# EAGLE design Gauge DAC v2 (EAGLE 9.1.0)
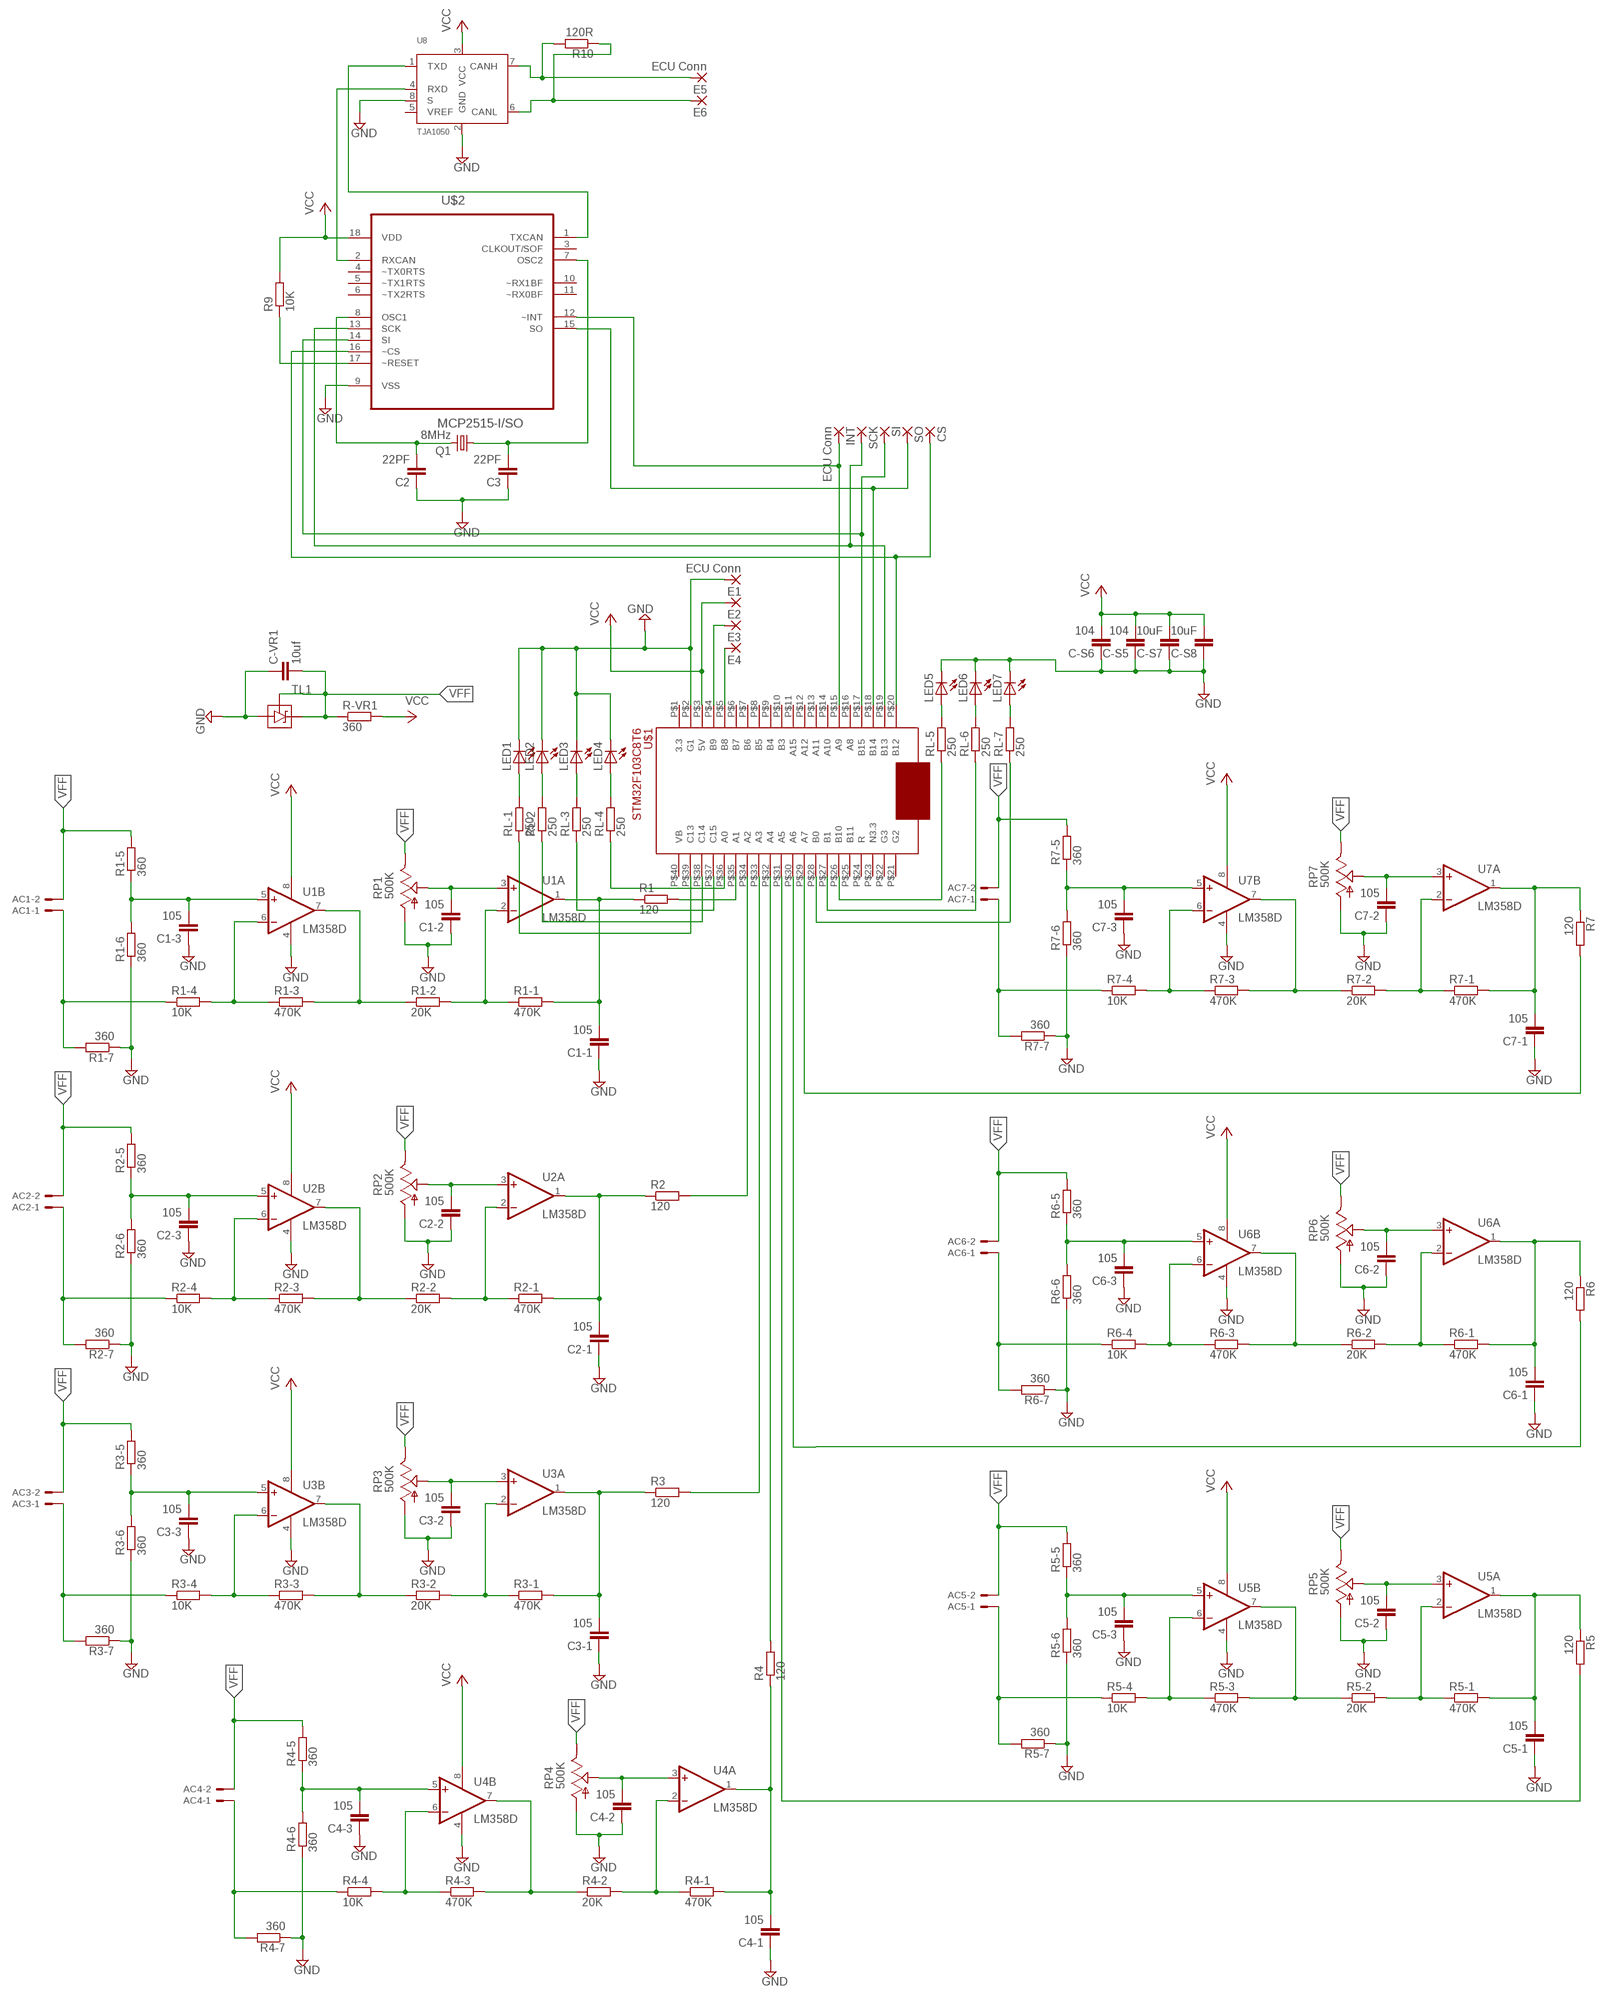
[diagram p0: schematic, sheet 1]

## Parts
AC1  JST-XH-02-PIN-ROUND-PAD  [JST-XH-02-PACKAGE-ROUND-PAD]
AC2  JST-XH-02-PIN-ROUND-PAD  [JST-XH-02-PACKAGE-ROUND-PAD]
AC3  JST-XH-02-PIN-ROUND-PAD  [JST-XH-02-PACKAGE-ROUND-PAD]
AC4  JST-XH-02-PIN-ROUND-PAD  [JST-XH-02-PACKAGE-ROUND-PAD]
AC5  JST-XH-02-PIN-ROUND-PAD  [JST-XH-02-PACKAGE-ROUND-PAD]
AC6  JST-XH-02-PIN-ROUND-PAD  [JST-XH-02-PACKAGE-ROUND-PAD]
AC7  JST-XH-02-PIN-ROUND-PAD  [JST-XH-02-PACKAGE-ROUND-PAD]
C1-1  105  C-EUC0805  [C0805]
C1-2  105  C-EUC0805  [C0805]
C1-3  105  C-EUC0805  [C0805]
C2  22PF  C-EUC0805  [C0805]
C2-1  105  C-EUC0805  [C0805]
C2-2  105  C-EUC0805  [C0805]
C2-3  105  C-EUC0805  [C0805]
C3  22PF  C-EUC0805  [C0805]
C3-1  105  C-EUC0805  [C0805]
C3-2  105  C-EUC0805  [C0805]
C3-3  105  C-EUC0805  [C0805]
C4-1  105  C-EUC0805  [C0805]
C4-2  105  C-EUC0805  [C0805]
C4-3  105  C-EUC0805  [C0805]
C5-1  105  C-EUC0805  [C0805]
C5-2  105  C-EUC0805  [C0805]
C5-3  105  C-EUC0805  [C0805]
C6-1  105  C-EUC0805  [C0805]
C6-2  105  C-EUC0805  [C0805]
C6-3  105  C-EUC0805  [C0805]
C7-1  105  C-EUC0805  [C0805]
C7-2  105  C-EUC0805  [C0805]
C7-3  105  C-EUC0805  [C0805]
C-S5  104  C-EUC0805  [C0805]
C-S6  104  C-EUC0805  [C0805]
C-S7  10uF  C-EUC0805  [C0805]
C-S8  10uF  C-EUC0805  [C0805]
C-VR1  10uf  C-EUC0805  [C0805]
CS  WIREPADSMD1,27-254  [SMD1,27-2,54]
E1  ECU Conn  WIREPADSMD1,27-254  [SMD1,27-2,54]
E2  WIREPADSMD1,27-254  [SMD1,27-2,54]
E3  WIREPADSMD1,27-254  [SMD1,27-2,54]
E4  WIREPADSMD1,27-254  [SMD1,27-2,54]
E5  ECU Conn  WIREPADSMD1,27-254  [SMD1,27-2,54]
E6  WIREPADSMD1,27-254  [SMD1,27-2,54]
INT  ECU Conn  WIREPADSMD1,27-254  [SMD1,27-2,54]
LED1  LEDCHIP-LED0805  [CHIP-LED0805]
LED2  LEDCHIP-LED0805  [CHIP-LED0805]
LED3  LEDCHIP-LED0805  [CHIP-LED0805]
LED4  LEDCHIP-LED0805  [CHIP-LED0805]
LED5  LEDCHIP-LED0805  [CHIP-LED0805]
LED6  LEDCHIP-LED0805  [CHIP-LED0805]
LED7  LEDCHIP-LED0805  [CHIP-LED0805]
Q1  8MHz  CRYSTALHC49S  [HC49/S]
R1  120  R-EU_M0805  [M0805]
R1-1  470K  R-EU_M0805  [M0805]
R1-2  20K  R-EU_M0805  [M0805]
R1-3  470K  R-EU_M0805  [M0805]
R1-4  10K  R-EU_M0805  [M0805]
R1-5  360  R-EU_M0805  [M0805]
R1-6  360  R-EU_M0805  [M0805]
R1-7  360  R-EU_M0805  [M0805]
R2  120  R-EU_M0805  [M0805]
R2-1  470K  R-EU_M0805  [M0805]
R2-2  20K  R-EU_M0805  [M0805]
R2-3  470K  R-EU_M0805  [M0805]
R2-4  10K  R-EU_M0805  [M0805]
R2-5  360  R-EU_M0805  [M0805]
R2-6  360  R-EU_M0805  [M0805]
R2-7  360  R-EU_M0805  [M0805]
R3  120  R-EU_M0805  [M0805]
R3-1  470K  R-EU_M0805  [M0805]
R3-2  20K  R-EU_M0805  [M0805]
R3-3  470K  R-EU_M0805  [M0805]
R3-4  10K  R-EU_M0805  [M0805]
R3-5  360  R-EU_M0805  [M0805]
R3-6  360  R-EU_M0805  [M0805]
R3-7  360  R-EU_M0805  [M0805]
R4  120  R-EU_M0805  [M0805]
R4-1  470K  R-EU_M0805  [M0805]
R4-2  20K  R-EU_M0805  [M0805]
R4-3  470K  R-EU_M0805  [M0805]
R4-4  10K  R-EU_M0805  [M0805]
R4-5  360  R-EU_M0805  [M0805]
R4-6  360  R-EU_M0805  [M0805]
R4-7  360  R-EU_M0805  [M0805]
R5  120  R-EU_M0805  [M0805]
R5-1  470K  R-EU_M0805  [M0805]
R5-2  20K  R-EU_M0805  [M0805]
R5-3  470K  R-EU_M0805  [M0805]
R5-4  10K  R-EU_M0805  [M0805]
R5-5  360  R-EU_M0805  [M0805]
R5-6  360  R-EU_M0805  [M0805]
R5-7  360  R-EU_M0805  [M0805]
R6  120  R-EU_M0805  [M0805]
R6-1  470K  R-EU_M0805  [M0805]
R6-2  20K  R-EU_M0805  [M0805]
R6-3  470K  R-EU_M0805  [M0805]
R6-4  10K  R-EU_M0805  [M0805]
R6-5  360  R-EU_M0805  [M0805]
R6-6  360  R-EU_M0805  [M0805]
R6-7  360  R-EU_M0805  [M0805]
R7  120  R-EU_M0805  [M0805]
R7-1  470K  R-EU_M0805  [M0805]
R7-2  20K  R-EU_M0805  [M0805]
R7-3  470K  R-EU_M0805  [M0805]
R7-4  10K  R-EU_M0805  [M0805]
R7-5  360  R-EU_M0805  [M0805]
R7-6  360  R-EU_M0805  [M0805]
R7-7  360  R-EU_M0805  [M0805]
R9  10K  R-EU_M0805  [M0805]
R10  120R  R-EU_M0805  [M0805]
R-VR1  360  R-EU_M0805  [M0805]
RL-1  250  R-EU_M0805  [M0805]
RL-2  250  R-EU_M0805  [M0805]
RL-3  250  R-EU_M0805  [M0805]
RL-4  250  R-EU_M0805  [M0805]
RL-5  250  R-EU_M0805  [M0805]
RL-6  250  R-EU_M0805  [M0805]
RL-7  250  R-EU_M0805  [M0805]
RP1  500K  TRIM_US-B64Y  [B64Y]
RP2  500K  TRIM_US-B64Y  [B64Y]
RP3  500K  TRIM_US-B64Y  [B64Y]
RP4  500K  TRIM_US-B64Y  [B64Y]
RP5  500K  TRIM_US-B64Y  [B64Y]
RP6  500K  TRIM_US-B64Y  [B64Y]
RP7  500K  TRIM_US-B64Y  [B64Y]
SCK  WIREPADSMD1,27-254  [SMD1,27-2,54]
SI  WIREPADSMD1,27-254  [SMD1,27-2,54]
SO  WIREPADSMD1,27-254  [SMD1,27-2,54]
TL1  TL431SOT23  [SOT23]
U1  LM358D  [SO08]
U2  LM358D  [SO08]
U3  LM358D  [SO08]
U4  LM358D  [SO08]
U5  LM358D  [SO08]
U6  LM358D  [SO08]
U7  LM358D  [SO08]
U8  TJA1050  [SOT96-1]
U$1  STM32F103C8T6DIP40  [STM32]
U$2  MCP2515-I/SO  [SOIC127P1034X264-18N]

## Nets
GND: C1-1.1 C1-2.1 C1-3.1 C2-1.1 C2-2.1 C2-3.1 C2.1 C3-1.1 C3-2.1 C3-3.1 C3.1 C4-1.1 C4-2.1 C4-3.1 C5-1.1 C5-2.1 C5-3.1 C6-1.1 C6-2.1 C6-3.1 C7-1.1 C7-2.1 C7-3.1 C-S5.1 C-S6.1 C-S7.1 C-S8.1 C-VR1.1 E1.1(P) LED1.C LED2.C LED3.C LED4.C LED5.C LED6.C LED7.C R1-6.1 R1-7.1 R2-6.1 R2-7.1 R3-6.1 R3-7.1 R4-6.1 R4-7.1 R5-6.1 R5-7.1 R6-6.1 R6-7.1 R7-6.1 R7-7.1 RP1.A RP2.A RP3.A RP4.A RP5.A RP6.A RP7.A TL1.3(ANODE) U1.4(P:V-) U2.4(P:V-) U3.4(P:V-) U4.4(P:V-) U5.4(P:V-) U6.4(P:V-) U7.4(P:V-) U8.2(GND) U8.8(S) U$1.P$2(G1) U$2.9(VSS)
N$1: SCK.1(P) U$1.P$19(B13) U$2.13(SCK)
N$2: CS.1(P) U$1.P$20(B12) U$2.16(~CS)
N$3: E3.1(P) U$1.P$4(B9)
N$4: E4.1(P) U$1.P$5(B8)
N$5: U8.1(TXD) U$2.1(TXCAN)
N$6: SO.1(P) U$1.P$18(B14) U$2.15(SO)
N$7: SI.1(P) U$1.P$17(B15) U$2.14(SI)
N$8: RL-4.1 U$1.P$36(A0)
N$9: RL-3.1 U$1.P$37(C15)
N$10: C7-1.2 R7-1.2 R7.1 U7.1(A:OUT)
N$11: C1-2.2 RP1.S U1.3(A:+IN)
N$12: R1-2.1 R1-3.2 U1.7(B:OUT)
N$13: R1-1.1 R1-2.2 U1.2(A:-IN)
N$14: RL-2.1 U$1.P$38(C14)
N$15: C1-3.2 R1-5.1 R1-6.2 U1.5(B:+IN)
N$16: R1-3.1 R1-4.2 U1.6(B:-IN)
N$17: AC1.1 R1-4.1 R1-7.2
N$18: C2-2.2 RP2.S U2.3(A:+IN)
N$19: R2-2.1 R2-3.2 U2.7(B:OUT)
N$20: R2-1.1 R2-2.2 U2.2(A:-IN)
N$21: C2-1.2 R2-1.2 R2.1 U2.1(A:OUT)
N$22: C2-3.2 R2-5.1 R2-6.2 U2.5(B:+IN)
N$23: R2-3.1 R2-4.2 U2.6(B:-IN)
N$24: AC2.1 R2-4.1 R2-7.2
N$25: RL-1.1 U$1.P$39(C13)
N$26: LED1.A RL-1.2
N$27: RL-7.1 U$1.P$28(B0)
N$28: RL-6.1 U$1.P$27(B1)
N$29: RL-5.1 U$1.P$26(B10)
N$30: LED2.A RL-2.2
N$31: LED3.A RL-3.2
N$32: C3-2.2 RP3.S U3.3(A:+IN)
N$33: R3-2.1 R3-3.2 U3.7(B:OUT)
N$34: R3-1.1 R3-2.2 U3.2(A:-IN)
N$35: C3-1.2 R3-1.2 R3.1 U3.1(A:OUT)
N$36: C3-3.2 R3-5.1 R3-6.2 U3.5(B:+IN)
N$37: R3-3.1 R3-4.2 U3.6(B:-IN)
N$38: AC3.1 R3-4.1 R3-7.2
N$39: LED4.A RL-4.2
N$40: LED5.A RL-5.2
N$41: LED6.A RL-6.2
N$42: LED7.A RL-7.2
N$44: R9.1 U$2.17(~RESET)
N$46: C4-2.2 RP4.S U4.3(A:+IN)
N$47: R4-2.1 R4-3.2 U4.7(B:OUT)
N$48: R4-1.1 R4-2.2 U4.2(A:-IN)
N$49: C4-1.2 R4-1.2 R4.1 U4.1(A:OUT)
N$50: C4-3.2 R4-5.1 R4-6.2 U4.5(B:+IN)
N$51: R4-3.1 R4-4.2 U4.6(B:-IN)
N$52: AC4.1 R4-4.1 R4-7.2
N$53: E6.1(P) R10.1 U8.6(CANL)
N$54: U8.4(RXD) U$2.2(RXCAN)
N$55: INT.1(P) U$1.P$15(A9) U$2.12(~INT)
N$60: C5-2.2 RP5.S U5.3(A:+IN)
N$61: R5-2.1 R5-3.2 U5.7(B:OUT)
N$62: R5-1.1 R5-2.2 U5.2(A:-IN)
N$63: C2.2 Q1.2 U$2.8(OSC1)
N$64: C5-3.2 R5-5.1 R5-6.2 U5.5(B:+IN)
N$65: R5-3.1 R5-4.2 U5.6(B:-IN)
N$66: AC5.1 R5-4.1 R5-7.2
N$67: C3.2 Q1.1 U$2.7(OSC2)
N$70: E5.1(P) R10.2 U8.7(CANH)
N$74: C6-2.2 RP6.S U6.3(A:+IN)
N$75: R6-2.1 R6-3.2 U6.7(B:OUT)
N$76: R6-1.1 R6-2.2 U6.2(A:-IN)
N$78: C6-3.2 R6-5.1 R6-6.2 U6.5(B:+IN)
N$79: R6-3.1 R6-4.2 U6.6(B:-IN)
N$80: AC6.1 R6-4.1 R6-7.2
N$88: C7-2.2 RP7.S U7.3(A:+IN)
N$89: R7-2.1 R7-3.2 U7.7(B:OUT)
N$90: R7-1.1 R7-2.2 U7.2(A:-IN)
N$92: C7-3.2 R7-5.1 R7-6.2 U7.5(B:+IN)
N$93: R7-3.1 R7-4.2 U7.6(B:-IN)
N$94: AC7.1 R7-4.1 R7-7.2
R1: R1.2 U$1.P$35(A1)
R2: R2.2 U$1.P$34(A2)
R3: R3.2 U$1.P$33(A3)
R4: R4.2 U$1.P$32(A4)
R5: R5.2 U$1.P$31(A5)
R6: R6.2 U$1.P$30(A6)
R7: R7.2 U$1.P$29(A7)
U1-1: C1-1.2 R1-1.2 R1.1 U1.1(A:OUT)
U5-1: C5-1.2 R5-1.2 R5.1 U5.1(A:OUT)
U6-1: C6-1.2 R6-1.2 R6.1 U6.1(A:OUT)
VCC: C-S5.2 C-S6.2 C-S7.2 C-S8.2 E2.1(P) R9.2 R-VR1.2 U1.8(P:V+) U2.8(P:V+) U3.8(P:V+) U4.8(P:V+) U5.8(P:V+) U6.8(P:V+) U7.8(P:V+) U8.3(VCC) U$1.P$3(5V) U$2.18(VDD)
VFF: AC1.2 AC2.2 AC3.2 AC4.2 AC5.2 AC6.2 AC7.2 C-VR1.2 R1-5.2 R2-5.2 R3-5.2 R4-5.2 R5-5.2 R6-5.2 R7-5.2 R-VR1.1 RP1.E RP2.E RP3.E RP4.E RP5.E RP6.E RP7.E TL1.1(CATHODE) TL1.2(REF)
Unconnected: U8.5(VREF) U$1.P$1(3.3) U$1.P$6(B7) U$1.P$7(B6) U$1.P$8(B5) U$1.P$9(B4) U$1.P$10(B3) U$1.P$11(A15) U$1.P$12(A12) U$1.P$13(A11) U$1.P$14(A10) U$1.P$16(A8) U$1.P$21(G2) U$1.P$22(G3) U$1.P$23(N3.3) U$1.P$24(R) U$1.P$25(B11) U$1.P$40(VB) U$2.3(CLKOUT/SOF) U$2.4(~TX0RTS) U$2.5(~TX1RTS) U$2.6(~TX2RTS) U$2.10(~RX1BF) U$2.11(~RX0BF)

## Library data of the parts
AC1-AC7 = Rembrandt Electronics - JST XH Connectors v1-0:JST-XH-02-PIN: JST XH Connector 2 Pin Wire to board connector. Pitch: 2,54 mm, (0.100") Number of pins: 2 Created by Rembrandt Electronics www.rembrandtelectronics.com
C1-1-C1-3 C2 C2-1-C2-3 C3 C3-1-C3-3 C4-1-C4-3 C5-1-C5-3 C6-1-C6-3 C7-1-C7-3 C-S5-C-S8 C-VR1 = rcl:C-EU: CAPACITOR, European symbol; SPICEPREFIX: C
CS E1-E6 INT SCK SI SO = wirepad:WIREPAD: Wire PAD connect wire on PCB
LED1-LED7 = led:LED: LED OSRAM: - CHIPLED LG R971, LG N971, LY N971, LG Q971, LY Q971, LO R971, LY R971 LH N974, LH R974 LS Q976, LO Q976, LY Q976 LO Q996 - Hyper CHIPLED LW Q18S LB Q993, LB Q99A, LB R99A - SideLED LS A670, LO A670, LY A670, LG A670, LP A670 LB A673, LV A673, LT A673, LW A673 LH A674 LY A675 LS A676, LA A676, LO A676, LY A676, LW A676 LS A679, LY A679, LG A679 - Hyper Micro SIDELED® LS Y876, LA Y876, LO Y876, LY Y876 LT Y87S - SmartLED LW L88C, LW L88S LB L89C, LB L89S, LG L890 LS L89K, LO L89K, LY L89K LS L896, LA L896, LO L896, LY L896 - TOPLED LS T670, LO T670, LY T670, LG T670, LP T670 LSG T670, LSP T670, LSY T670, LOP T670, LYG T670 LG T671, LOG T671, LSG T671 LB T673, LV T673, LT T673, LW T673 LH T674 LS T676, LA T676, LO T676, LY T676, LB T676, LH T676, LSB T676, LW T676 LB T67C, LV T67C, LT T67C, LS T67K, LO T67K, LY T67K, LW E67C LS E67B, LA E67B, LO E67B, LY E67B, LB E67C, LV E67C, LT E67C LW T67C LS T679, LY T679, LG T679 LS T770, LO T770, LY T770, LG T770, LP T770 LB T773, LV T773, LT T773, LW T773 LH T774 LS E675, LA E675, LY E675, LS T675 LS T776, LA T776, LO T776, LY T776, LB T776 LHGB T686 LT T68C, LB T68C - Hyper Mini TOPLED® LB M676 - Mini TOPLED Santana® LG M470 LS M47K, LO M47K, LY M47K Source: http://www.osram.convergy.de LUXEON: - LUMILED® LXK2-PW12-R00, LXK2-PW12-S00, LXK2-PW14-U00, LXK2-PW14-V00 LXK2-PM12-R00, LXK2-PM12-S00, LXK2-PM14-U00 LXK2-PE12-Q00, LXK2-PE12-R00, LXK2-PE12-S00, LXK2-PE14-T00, LXK2-PE14-U00 LXK2-PB12-K00, LXK2-PB12-L00, LXK2-PB12-M00, LXK2-PB14-N00, LXK2-PB14-P00, LXK2-PB14-Q00 LXK2-PR12-L00, LXK2-PR12-M00, LXK2-PR14-Q00, LXK2-PR14-R00 LXK2-PD12-Q00, LXK2-PD12-R00, LXK2-PD12-S00 LXK2-PH12-R00, LXK2-PH12-S00 LXK2-PL12-P00, LXK2-PL12-Q00, LXK2-PL12-R00 Source: www.luxeon.com KINGBRIGHT: KA-3528ASYC Source: www.kingbright.com
Q1 = crystal:CRYSTAL: CRYSTAL; OC_FARNELL: 1667008; OC_NEWARK: unknown
R1 R1-1-R1-7 R2 R2-1-R2-7 R3 R3-1-R3-7 R4 R4-1-R4-7 R5 R5-1-R5-7 R6 R6-1-R6-7 R7 R7-1-R7-7 R9 R10 R-VR1 RL-1-RL-7 = rcl:R-EU_: RESISTOR, European symbol; SPICEPREFIX: R
RP1-RP7 = pot:TRIM_US-: POTENTIOMETER; SPICEPREFIX: J
TL1 = Components:TL431: TL431 Adjustable Voltage Regular SOT-23-3
U1-U7 = linear:LM358: OP AMP also LM158; LM258; LM2904 Source: http://cache.national.com/ds/LM/LM158.pdf; SPICEPREFIX: J
U8 = TJA1050:TJA1050: High speed CAN transceiver The TJA1050 is the interface between the Controller Area Network (CAN) protocol controller and the physical bus. The device provides differential transmit capability to the bus and differential receive capability to the CAN controller. The TJA1050 is the third Philips high-speed CAN transceiver after the PCA82C250 and the PCA82C251. The most important differences are: Much lower electromagnetic emission due to optimal matching of the output signals CANH and CANL Improved behaviour in case of an unpowered node No standby mode. This makes the TJA1050 eminently suitable for use in nodes that are in a power-down situation in partially powered networks. AAL Eindhoven MK; AVAILABILITY: Unavailable; MF: NXP Semiconductors; MP: TJA1050; PACKAGE: None; PRICE: None
U$1 = Components:STM32F103C8T6
U$2 = MCP2515-I_SO:MCP2515-I/SO: CAN Controller; AVAILABILITY: Unavailable; DESCRIPTION: MCP2515 Series 5.5 V 1 Mb/s Stand Alone SPI Interface CAN Controller- SOIC-18; MF: Microchip; MP: MCP2515-I/SO; PACKAGE: SOIC-18 Microchip; PRICE: None

## Board
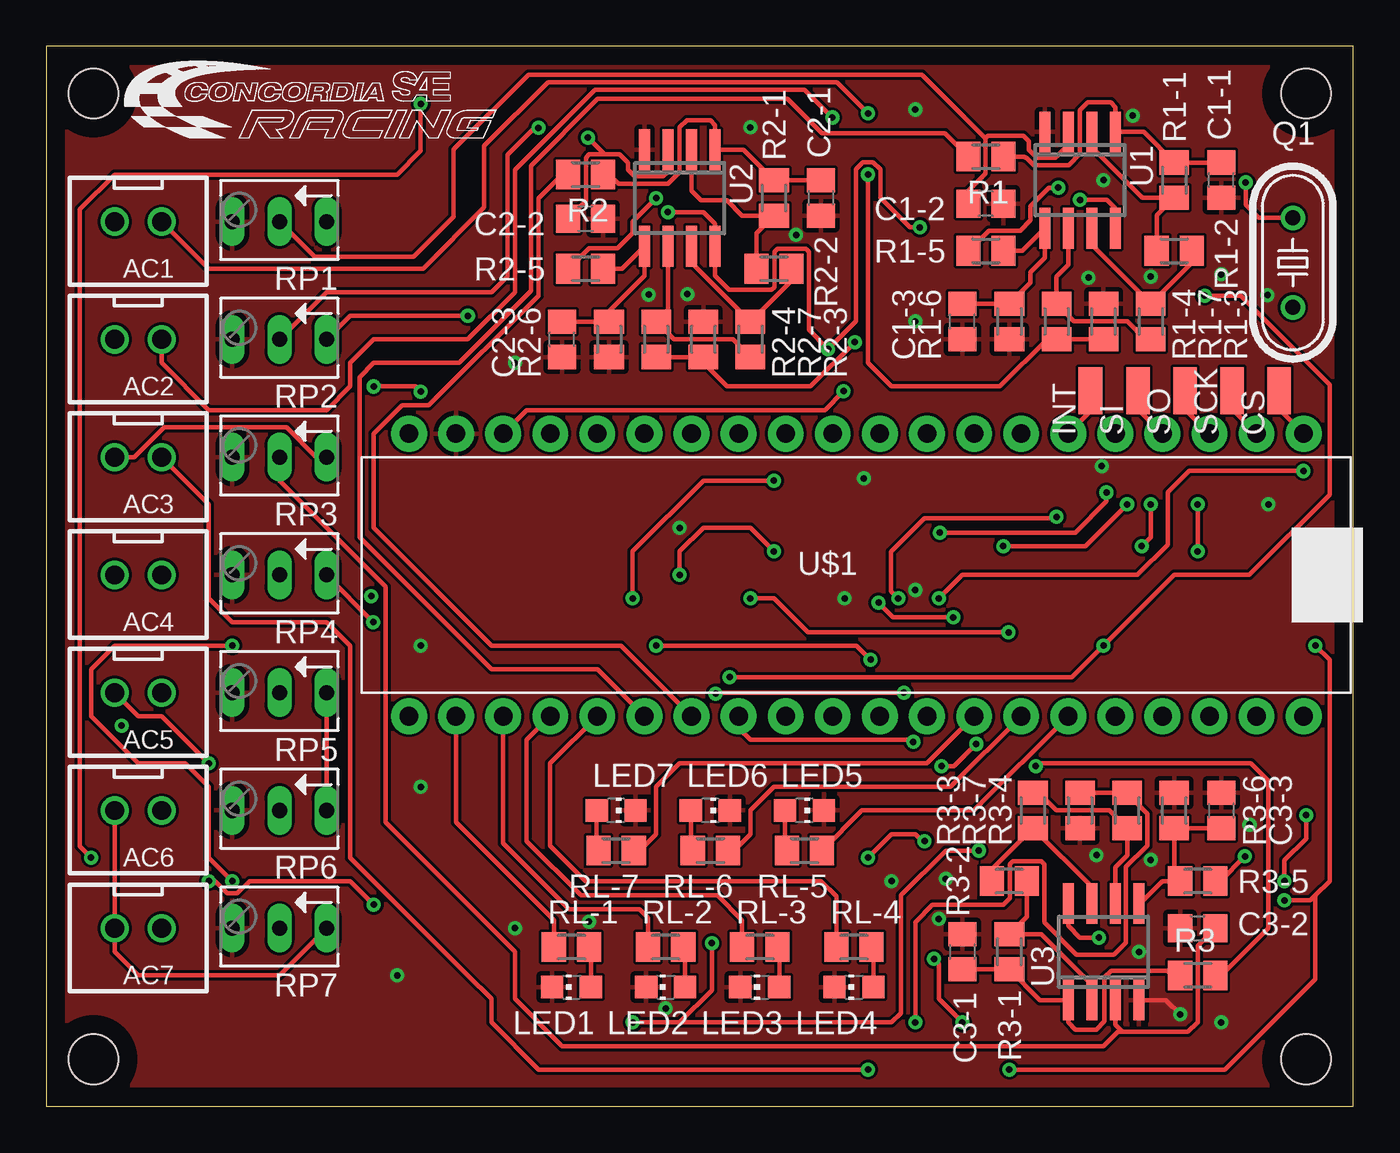
[diagram p1: board, top side]
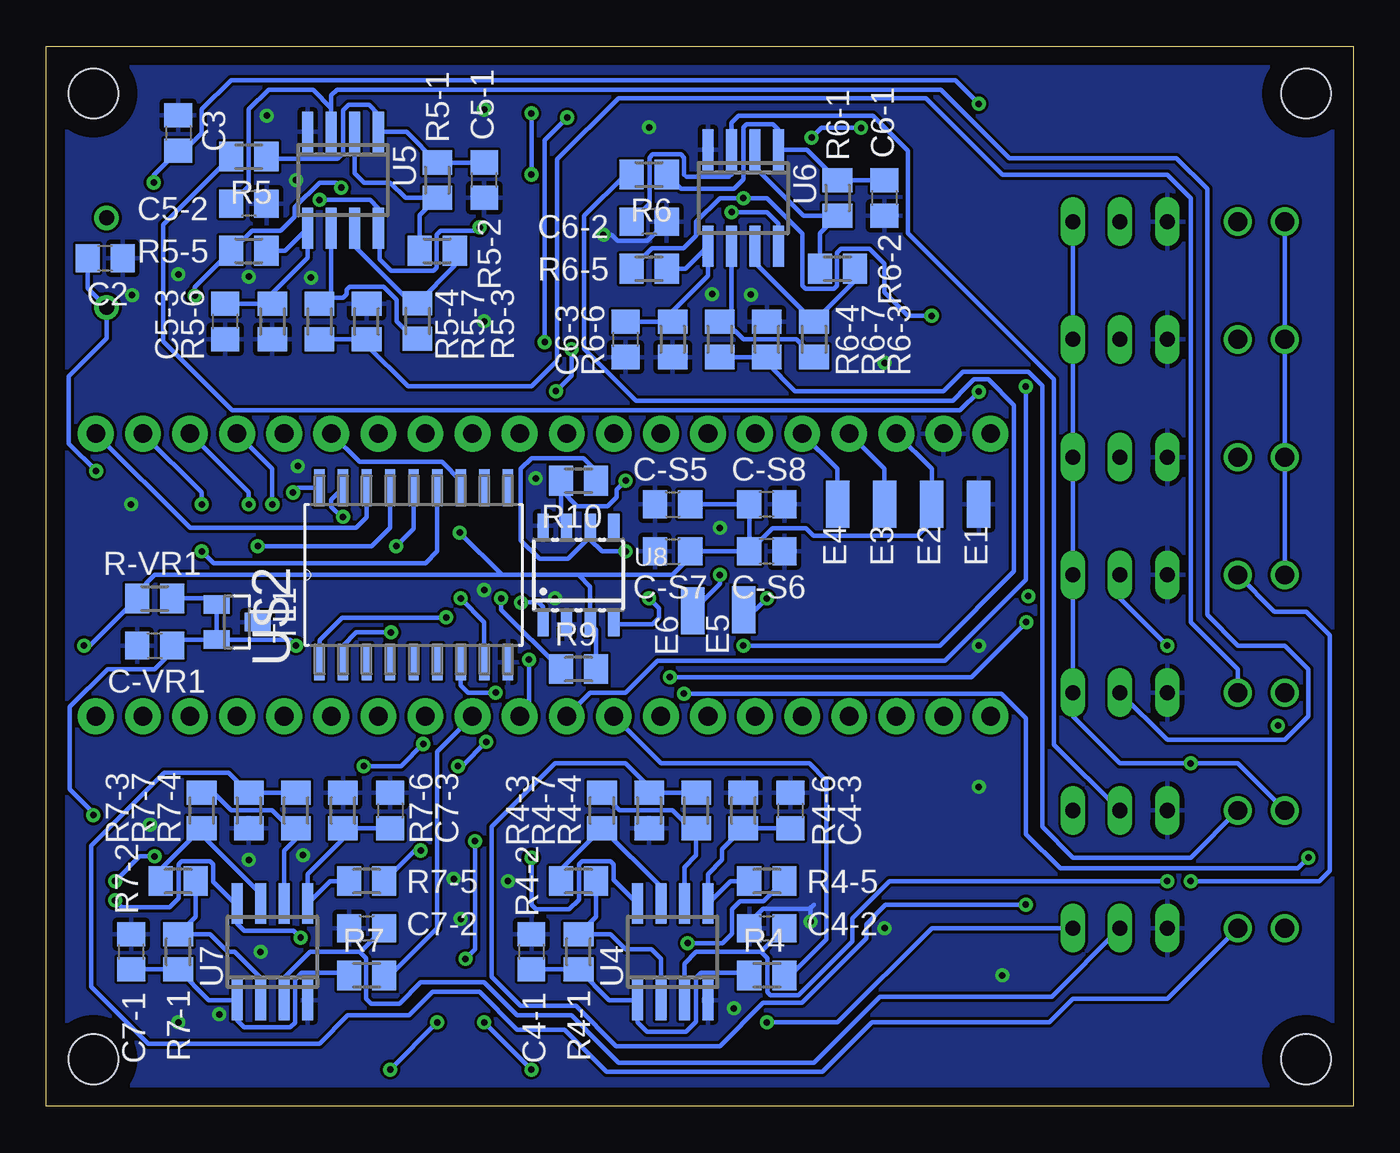
[diagram p2: board, bottom side, seen from below]

Size 70.48 x 57.15 mm. Coordinates in mm from the lower left corner, seen from the top.
Outline: 0,0 70.48,0 70.48,57.15 0,57.15 0,0
Copper layers (1*16): Top 0.035mm / dielectric 1.5mm / Bottom 0.035mm
Design rules "jlcpcb": minimum track width 3.5mil, minimum drill 0.2mm, track to track 3.5mil, track to pad 3.5mil, pad to pad 3.5mil, via to via 3.5mil, smd to smd 0mil, copper to edge 40mil, drill to drill 6mil, minimum pad ring 10mil, minimum via ring 8mil, stop-mask expansion 4mil, vias tented up to drill 0mil, thermal gap 10mil
Holes 2.7 mm at 2.54,54.61 67.94,54.61 2.54,2.54 67.94,2.54

### Footprints (pad centres in the part's own frame; a part is rotated, then mirrored left to right if it is on the bottom)
JST-XH-02-PACKAGE-ROUND-PAD = drill 1.016: 1 -1.27,0; 2 1.27,0
C0805 = smd 1.3 x 1.5: 1 -0.95,0; 2 0.95,0
SMD1,27-2,54 = smd 1.27 x 2.54: 1 0,0
CHIP-LED0805 = smd 1.2 x 1.2: A 0,-1.05; C 0,1.05
HC49/S = drill 0.813: 1 -2.413,0; 2 2.413,0
M0805 = smd 1.3 x 1.6: 1 -0.95,0; 2 0.95,0
B64Y = drill 0.813 long: A 2.54,0; E -2.54,0; S 0,0
SOT23 = smd 1 x 1.4: 1 -0.95,-1.1; 2 0.95,-1.1; 3 0,1.1
SO08 = smd 0.6 x 2.2: 1 -1.905,-2.6; 2 -0.635,-2.6; 3 0.635,-2.6; 4 1.905,-2.6; 5 1.905,2.6; 6 0.635,2.6; 7 -0.635,2.6; 8 -1.905,2.6
SOT96-1 = smd 0.6 x 1.3: 1 -1.905,-2.65; 2 -0.635,-2.65; 3 0.635,-2.65; 4 1.905,-2.65; 5 1.905,2.65; 6 0.635,2.65; 7 -0.635,2.65; 8 -1.905,2.65
STM32 = drill 1 pad 1.93: P$1 -7.62,-20.955; P$2 -7.62,-18.415; P$3 -7.62,-15.875; P$4 -7.62,-13.335; P$5 -7.62,-10.795; P$6 -7.62,-8.255; P$7 -7.62,-5.715; P$8 -7.62,-3.175; P$9 -7.62,-0.635; P$10 -7.62,1.905; P$11 -7.62,4.445; P$12 -7.62,6.985; P$13 -7.62,9.525; P$14 -7.62,12.065; P$15 -7.62,14.605; P$16 -7.62,17.145; P$17 -7.62,19.685; P$18 -7.62,22.225; P$19 -7.62,24.765; P$20 -7.62,27.305; P$21 7.62,27.305; P$22 7.62,24.765; P$23 7.62,22.225; P$24 7.62,19.685; P$25 7.62,17.145; P$26 7.62,14.605; P$27 7.62,12.065; P$28 7.62,9.525; P$29 7.62,6.985; P$30 7.62,4.445; P$31 7.62,1.905; P$32 7.62,-0.635; P$33 7.62,-3.175; P$34 7.62,-5.715; P$35 7.62,-8.255; P$36 7.62,-10.795; P$37 7.62,-13.335; P$38 7.62,-15.875; P$39 7.62,-18.415; P$40 7.62,-20.955
SOIC127P1034X264-18N = smd 1.981 x 0.559: 1 -4.699,5.08; 2 -4.699,3.81; 3 -4.699,2.54; 4 -4.699,1.27; 5 -4.699,0; 6 -4.699,-1.27; 7 -4.699,-2.54; 8 -4.699,-3.81; 9 -4.699,-5.08; 10 4.699,-5.08; 11 4.699,-3.81; 12 4.699,-2.54; 13 4.699,-1.27; 14 4.699,0; 15 4.699,1.27; 16 4.699,2.54; 17 4.699,3.81; 18 4.699,5.08

### Placement (x,y rotation side)
AC1  4.95,47.7 180 top
AC2  4.95,41.35 180 top
AC3  4.95,35 180 top
AC4  4.95,28.65 180 top
AC5  4.95,22.3 180 top
AC6  4.95,15.95 180 top
AC7  4.95,9.6 180 top
C1-1  63.37,49.94 90 top
C1-2  50.67,48.67 180 top
C1-3  49.4,42.32 90 top
C2  67.31,45.72 180 bottom
C2-1  41.78,48.97 90 top
C2-2  29.08,47.85 180 top
C2-3  27.81,41.35 90 top
C3  63.37,52.48 270 bottom
C3-1  49.4,8.33 270 top
C3-2  62.1,9.6 0 top
C3-3  63.37,15.95 270 top
C4-1  44.32,8.33 270 bottom
C4-2  31.62,9.6 0 bottom
C4-3  30.35,15.95 270 bottom
C5-1  46.86,49.94 90 bottom
C5-2  59.56,48.67 180 bottom
C5-3  60.83,42.32 90 bottom
C6-1  25.27,48.97 90 bottom
C6-2  37.97,47.7 180 bottom
C6-3  39.24,41.35 90 bottom
C7-1  65.91,8.33 270 bottom
C7-2  53.21,9.6 0 bottom
C7-3  51.94,15.95 270 bottom
C-S5  36.7,32.46 0 bottom
C-S6  31.62,29.92 180 bottom
C-S7  36.7,29.92 0 bottom
C-S8  31.62,32.46 180 bottom
C-VR1  64.64,24.84 0 bottom
CS  66.5,38.58 0 top
E1  20.19,32.46 0 bottom
E2  22.73,32.46 0 bottom
E3  25.27,32.46 0 bottom
E4  27.81,32.46 0 bottom
E5  32.87,26.77 0 bottom
E6  35.61,26.72 0 bottom
INT  56.31,38.58 0 top
LED1  28.32,6.43 90 top
LED2  33.4,6.43 90 top
LED3  38.48,6.43 90 top
LED4  43.56,6.43 90 top
LED5  40.89,15.95 270 top
LED6  35.81,15.95 270 top
LED7  30.73,15.95 270 top
Q1  67.23,45.49 270 top
R1  50.67,51.21 180 top
R1-1  60.83,49.94 90 top
R1-2  60.83,46.13 180 top
R1-3  59.56,42.32 90 top
R1-4  54.48,42.32 90 top
R1-5  50.67,46.13 180 top
R1-6  51.94,42.32 90 top
R1-7  57.02,42.32 270 top
R2  29.08,50.24 180 top
R2-1  39.24,48.97 90 top
R2-2  39.24,45.16 180 top
R2-3  37.97,41.35 90 top
R2-4  32.89,41.35 90 top
R2-5  29.08,45.16 180 top
R2-6  30.35,41.35 90 top
R2-7  35.43,41.35 270 top
R3  62.1,7.06 0 top
R3-1  51.94,8.33 270 top
R3-2  51.94,12.14 0 top
R3-3  53.21,15.95 270 top
R3-4  58.29,15.95 270 top
R3-5  62.1,12.14 0 top
R3-6  60.83,15.95 270 top
R3-7  55.75,15.95 90 top
R4  31.62,7.06 0 bottom
R4-1  41.78,8.33 270 bottom
R4-2  41.78,12.14 0 bottom
R4-3  40.51,15.95 270 bottom
R4-4  35.43,15.95 270 bottom
R4-5  31.62,12.14 0 bottom
R4-6  32.89,15.95 270 bottom
R4-7  37.97,15.95 90 bottom
R5  59.56,51.21 180 bottom
R5-1  49.4,49.94 90 bottom
R5-2  49.4,46.13 180 bottom
R5-3  50.47,42.34 90 bottom
R5-4  55.75,42.32 90 bottom
R5-5  59.56,46.13 180 bottom
R5-6  58.29,42.32 90 bottom
R5-7  53.21,42.32 270 bottom
R6  37.97,50.24 180 bottom
R6-1  27.81,48.97 90 bottom
R6-2  27.81,45.16 180 bottom
R6-3  29.08,41.35 90 bottom
R6-4  34.16,41.35 90 bottom
R6-5  37.97,45.16 180 bottom
R6-6  36.7,41.35 90 bottom
R6-7  31.62,41.35 270 bottom
R7  53.21,7.06 0 bottom
R7-1  63.37,8.33 270 bottom
R7-2  63.37,12.14 0 bottom
R7-3  62.1,15.95 270 bottom
R7-4  57.02,15.95 270 bottom
R7-5  53.21,12.14 0 bottom
R7-6  54.48,15.95 270 bottom
R7-7  59.56,15.95 90 bottom
R9  41.78,23.57 0 bottom
R10  41.78,33.73 180 bottom
R-VR1  64.64,27.38 180 bottom
RL-1  28.32,8.59 0 top
RL-2  33.4,8.59 0 top
RL-3  38.48,8.59 0 top
RL-4  43.56,8.59 0 top
RL-5  40.89,13.79 180 top
RL-6  35.81,13.79 180 top
RL-7  30.73,13.79 180 top
RP1  12.57,47.7 180 top
RP2  12.57,41.35 180 top
RP3  12.57,35 180 top
RP4  12.57,28.65 180 top
RP5  12.57,22.3 180 top
RP6  12.57,15.95 180 top
RP7  12.57,9.6 180 top
SCK  63.96,38.58 0 top
SI  58.88,38.58 0 top
SO  61.42,38.58 0 top
TL1  60.2,26.11 270 bottom
U1  55.75,49.94 180 top
U2  34.16,48.97 180 top
U3  57.02,8.33 0 top
U4  36.7,8.33 0 bottom
U5  54.48,49.94 180 bottom
U6  32.89,48.97 180 bottom
U7  58.29,8.33 0 bottom
U8  41.78,28.65 0 bottom
U$1  40.51,28.65 270 top
U$2  50.67,28.65 90 bottom

### Tracks (layer width: path | path; a pad name or v marks a point on that pad's centre or on a via)
GND  (via drill 0.35)
  Top 0.254: U3.4 60.38,5.73 v61.16,4.95
  Bottom 0.254: v40.44,46.99 40.01,46.99 39.69,46.67 38.05,46.67 C6-2.1 | C4-2.1 32.57,9.92 31.84,10.66 29.3,10.66 29.08,10.87 29.26,10.69 v29.26,9.96
  other vias: 48.51,12.27 46.86,53.75 18.92,7.06 64.9,15.19 34.16,31.19 59.56,44.73 59.56,13.28 48.13,10.11 45.59,12.14 25.27,9.6 33.4,5.28 56.64,13.54 58.93,8.33 63.37,4.52 37.97,52.78 25.27,40.08 34.57,43.79 56.21,44.68 63.37,44.86 46.86,42.32 65.86,43.74 58.6,53.42 32.49,43.76 57.02,49.94 43.05,27.38 46.86,27.84 20.19,17.22 56.92,34.52 20.19,24.84 65.91,32.46 44.09,33.86
  pour Top (isolate 0.152): -1.91,58.47 -1.91,-1.22 74.3,-1.22 74.3,58.47
  pour Bottom (isolate 0.152): -3.17,59.74 -3.17,-2.49 75.56,-2.49 75.56,59.74
N$1  (via drill 0.35)
  Top 0.254: v62.1,32.46 v62.1,29.92 | SCK.1 63.96,37.59 U$1.P$19
  Bottom 0.254: U$1.P$19 62.1,33.1 v62.1,32.46 | v62.1,29.92 61.47,29.29 50.04,29.29 49.4,29.92 U$2.13
N$2
  Top 0.254: CS.1 66.5,37.59 U$1.P$20
  Bottom 0.254: U$1.P$20 62.74,31.19 53.77,31.19 53.21,31.75 U$2.16
N$3
  Bottom 0.254: E3.1 25.27,34.37 U$1.P$4
N$4
  Bottom 0.254: E4.1 27.81,34.37 U$1.P$5
N$5  (via drill 0.35)
  Top 0.254: v48.92,26.36 45.67,26.36 v44.88,27.15
  Bottom 0.254: U$2.1 55.75,25.12 54.53,26.34 48.95,26.34 v48.92,26.36 | v44.88,27.15 44.86,27.18 43.94,27.18 43.69,26.92 U8.1
N$6  (via drill 0.35)
  Top 0.254: v59.08,30.2 59.56,30.68 v59.56,32.46 | SO.1 61.42,37.59 U$1.P$18
  Bottom 0.254: U$1.P$18 59.56,33.1 v59.56,32.46 | v59.08,30.2 52.93,30.2 51.94,31.19 U$2.15
N$7  (via drill 0.35)
  Top 0.254: v58.29,32.46 56.03,30.2 v51.61,30.2 | SI.1 58.88,37.59 U$1.P$17
  Bottom 0.254: U$1.P$17 58.29,34.37 v58.29,32.46 | v51.61,30.2 50.67,31.14 U$2.14
N$8
  Top 0.254: RL-4.1 42.61,11.31 41.78,12.14 29.08,12.14 27.18,14.05 27.18,15.32 27.18,18.49 U$1.P$36
N$9
  Top 0.254: RL-3.1 37.53,10.04 36.2,11.38 28.83,11.38 25.91,14.3 25.91,19.76 U$1.P$37
N$10
  Bottom 0.254: C7-1.2 R7-1.2 61.72,5.73 U7.1 60.2,4.65 59.82,4.27 57.33,4.27 57.08,4.51 57.08,6.84 56.73,7.19 54.29,7.19 R7.1
N$11
  Top 0.254: C1-2.2 49.72,49.36 50.65,50.29 50.65,52.2 | RP1.S 14.48,45.8 19.81,45.8 21.97,47.95 21.97,51.6 26,55.63 47.23,55.63 50.65,52.2 | U1.3 55.12,51.84 54.43,51.16 53.43,51.16 53.03,51.56 52.98,51.56 52.98,52.05 52.7,52.32 50.77,52.32 50.65,52.2
N$12
  Top 0.254: R1-2.1 61.78,45.49 R1-3.2 56.39,46.44 U1.7
N$13
  Top 0.254: R1-2.2 59.88,47.4 59.88,48.04 R1-1.1 59.12,48.99 56.39,51.71 U1.2
N$14
  Top 0.254: RL-2.1 32.45,10.17 32,10.62 28.19,10.62 24.64,14.17 U$1.P$38
N$15
  Top 0.254: C1-3.2 R1-6.2 53.09,44.41 53.09,44.98 53.85,45.74 U1.5 52.64,46.13 R1-5.1
N$16
  Top 0.254: U1.6 55.12,45.36 54.48,44.73 R1-4.2 55.43,42.32 58.29,42.32 59.24,41.37 R1-3.1
N$17  (via drill 0.35)
  Top 0.254: R1-7.2 R1-4.1 53.99,41.37 51.44,38.81 45.59,38.81 44.32,40.08 v44.32,50.24 | AC1.1 8.76,45.16 20.32,45.16 23.62,48.46 23.62,51.78 27.06,55.22 42.65,55.22 v44.32,53.54
  Bottom 0.254: v44.32,53.54 v44.32,50.24
N$18  (via drill 0.35)
  Top 0.254: C2-2.2 29.1,48.82 29.1,51.16 29.27,51.32 30.11,51.32 | RP2.S 15.11,43.89 24,43.89 24.87,44.76 24.87,51.3 26.33,52.76 v26.54,52.76 | U2.3 33.53,50.39 33.27,50.14 31.73,50.14 31.37,50.49 31.37,50.88 30.93,51.32 30.35,51.32 30.11,51.32 | v29.2,52.23 30.11,51.32
  Bottom 0.254: v26.54,52.76 28.68,52.76 v29.2,52.23
N$19
  Top 0.254: R2-2.1 40.19,44.52 R2-3.2 34.8,45.48 U2.7
N$20
  Top 0.254: R2-2.2 38.29,47.07 R2-1.1 37.53,48.02 36.7,48.84 35.31,48.84 34.8,49.35 U2.2
N$21
  Top 0.254: C2-1.2 R2-1.2 37.59,51.57 U2.1 36.07,52.91 35.81,53.16 34.54,53.16 34.16,52.78 34.16,50.37 33.53,49.73 30.86,49.73 30.35,50.24 R2.1
N$22
  Top 0.254: C2-3.2 R2-6.2 30.35,42.88 32.26,44.78 U2.5 31.05,45.16 R2-5.1
N$23
  Top 0.254: U2.6 33.53,42.94 R2-4.2 33.84,41.35 37.02,41.35 R2-3.1
N$24  (via drill 0.35)
  Top 0.254: R2-4.1 R2-7.2 35.43,40.08 36.7,38.81 41.22,38.81 v43.61,41.2 | AC2.1 6.22,40.08 8.76,37.54 15.11,37.54 16.38,38.81 16.38,40.08 17.65,41.35 22.73,41.35 25.27,43.89 25.27,50.49 29.59,54.81 40.89,54.81 v42.39,53.31
  Bottom 0.254: v43.61,41.2 43.61,52.09 v42.39,53.31
N$25
  Top 0.254: RL-1.1 27.37,10.04 22.1,15.32 U$1.P$39
N$26
  Top 0.254: RL-1.2 29.37,8.48 LED1.A
N$27
  Top 0.254: U$1.P$28 47.5,18.49 34.16,18.49 32.89,17.22 32.89,14.68 32,13.79 RL-7.1
N$28
  Top 0.254: U$1.P$27 48.77,17.22 39.24,17.22 37.97,15.95 37.97,14.68 37.08,13.79 RL-6.1
N$29
  Top 0.254: U$1.P$26 50.04,15.95 44,15.95 RL-5.1
N$30
  Top 0.254: RL-2.2 34.45,8.48 LED2.A
N$31
  Top 0.254: RL-3.2 39.53,8.48 LED3.A
N$32
  Top 0.254: C3-2.2 62.1,8.65 62.1,4.54 61.57,4.01 58.29,4.01 | 58.29,4.01 58.04,4.01 57.66,4.39 U3.3 | RP3.S 12.57,33.73 18.29,28.02 18.29,15.32 25.27,8.33 25.27,5.79 27.81,3.25 57.02,3.25 57.78,4.01 58.29,4.01
N$33
  Top 0.254: R3-2.1 50.99,12.78 R3-3.2 56.39,11.83 U3.7
N$34
  Top 0.254: R3-2.2 52.89,10.23 R3-1.1 53.66,9.28 56.39,6.55 U3.2
N$35
  Top 0.254: C3-1.2 R3-1.2 53.59,5.73 U3.1 55.12,4.52 55.5,4.14 56.64,4.14 57.08,4.58 57.08,6.95 57.45,7.32 60.45,7.32 60.71,7.06 R3.1
N$36
  Top 0.254: C3-3.2 R3-6.2 60.83,12.46 R3-5.1 60.19,12.14 58.98,10.93 U3.5
N$37
  Top 0.254: U3.6 57.66,12.9 58.29,13.54 R3-4.2 57.34,15.95 54.48,15.95 53.53,16.9 R3-3.1
N$38  (via drill 0.35)
  Top 0.254: R3-7.2 R3-4.1 58.24,16.9 59.37,15.77 59.37,14.04 58.24,12.91 58.24,8.83 57.59,8.18 55.57,8.18 53.82,9.92 53.82,13.06 53.66,13.22 52.13,13.22 51.96,13.06 51.96,11.22 51.61,10.87 47.8,10.87 46.86,9.93 v46.86,4.52 | AC3.1 8.76,32.46 8.76,27.38 10.03,26.11 15.11,26.11 16.38,24.84 16.38,13.41 22.73,7.06 24,5.79 24,4.52 26.54,1.98 v44.32,1.98
  Bottom 0.254: v44.32,1.98 v46.86,4.52
N$39
  Top 0.254: RL-4.2 44.61,8.48 LED4.A
N$40
  Top 0.254: RL-5.2 39.84,13.89 LED5.A
N$41
  Top 0.254: RL-6.2 34.76,13.89 LED6.A
N$42
  Top 0.254: RL-7.2 29.68,13.89 LED7.A
N$43  (via drill 0.35)
  other vias: 17.53,27.51
N$44  (via drill 0.35)
  Top 0.254: v54.48,31.79 54.4,31.7 47.37,31.7 45.57,29.9 45.57,27.76 v45.95,27.38
  Bottom 0.254: R9.1 45.95,26.79 v45.95,27.38 | v54.48,31.79 54.57,31.79 55.12,32.33 55.12,32.72 U$2.17
N$45  (via drill 0.35)
  other vias: 4.06,20.52
N$46  (via drill 0.35)
  Top 0.254: v10.03,24.84 3.68,24.84 2.41,23.57 2.41,21.03 4.95,18.49 7.49,18.49 8.76,17.22 8.76,13.41 v10.03,12.14
  Bottom 0.254: C4-2.2 31.94,8.33 | 31.94,8.33 35.43,8.33 36.07,7.7 U4.3 | RP4.S 12.57,27.38 v10.03,24.84 | v10.03,12.14 25.01,12.14 27,10.15 27,8.89 29.91,5.98 31.44,5.98 31.6,6.14 31.6,7.99 31.94,8.33
N$47
  Bottom 0.254: R4-2.1 42.73,12.78 R4-3.2 37.34,11.83 U4.7
N$48
  Bottom 0.254: R4-2.2 40.83,10.23 R4-1.1 40.07,9.28 39.24,8.46 37.85,8.46 37.34,7.95 U4.2
N$49
  Bottom 0.254: C4-1.2 R4-1.2 40.13,5.73 U4.1 38.61,4.52 38.1,4.01 35.99,4.01 35.43,4.57 35.43,6.93 35.18,7.19 33.02,7.19 32.89,7.06 R4.1
N$50
  Bottom 0.254: C4-3.2 R4-6.2 34.04,13.86 34.04,13.28 34.8,12.52 U4.5 33.59,12.14 R4-5.1
N$51
  Bottom 0.254: U4.6 36.07,12.9 35.43,13.54 R4-4.2 35.75,15 36.7,15.95 39.56,15.95 R4-3.1
N$52  (via drill 0.35)
  Top 0.254: v17.65,10.87 16.38,12.14 10.96,12.14 10.3,11.48 9.76,11.48 9.1,12.14 v8.76,12.14
  Bottom 0.254: R4-4.1 R4-7.2 37.97,17.22 39.24,18.49 43.05,18.49 46.48,15.06 46.48,6.98 44.91,5.41 41.91,5.41 39.75,3.25 34.16,3.25 31.84,5.58 29.74,5.58 26.26,9.05 26.26,9.83 25.22,10.87 v17.65,10.87 | AC4.1 4.24,26.67 2.54,26.67 1.27,25.4 1.27,12.7 1.83,12.14 v8.76,12.14
N$53  (via drill 0.35)
  Top 0.254: v34.16,28.65 34.16,29.92 35.43,31.19 37.97,31.19 v39.24,29.92
  Bottom 0.254: E6.1 34.16,28.17 v34.16,28.65 | v39.24,29.92 40.51,29.92 41.15,30.56 41.15,30.96 | R10.1 40.83,34.28 41.5,34.95 44.32,34.95 44.91,34.37 44.91,30.53 43.89,29.52 42.34,29.52 41.15,30.71 41.15,30.96 | 41.15,30.96 U8.6
N$54  (via drill 0.35)
  Top 0.254: v51.89,25.55 41.07,25.55 39.24,27.38 v37.97,27.38
  Bottom 0.254: U$2.2 54.48,24.84 53.77,25.55 v51.89,25.55 | v37.97,27.38 37.44,26.85 37.44,26.34 37.78,26 U8.4
N$55
  Top 0.254: INT.1 56.31,37.47 U$1.P$15
  Bottom 0.254: U$1.P$15 53.59,34.75 49.15,34.75 48.13,33.73 U$2.12
N$60
  Bottom 0.254: C5-2.2 59.56,49.62 59.56,53.75 58.5,54.81 56.11,54.81 55.12,53.82 | RP5.S 10.03,19.76 3.68,19.76 2.41,21.03 2.41,23.57 3.68,24.84 6.22,24.84 7.87,26.49 7.87,49.48 9.53,51.13 18.54,51.13 22.23,54.81 54.81,54.81 55.12,54.51 55.12,53.82 | 55.12,53.82 U5.3
N$61
  Bottom 0.254: R5-2.1 48.45,45.31 R5-3.2 50.77,43.29 53.85,46.37 U5.7
N$62
  Bottom 0.254: R5-2.2 50.35,48.04 R5-1.1 51.12,48.99 51.94,49.81 53.34,49.81 53.85,50.32 U5.2
N$63  (via drill 0.35)
  Top 0.254: v48.13,27.38 49.4,28.65 58.85,28.65 60.49,30.29 60.49,33.11 61.64,34.26 v67.8,34.26
  Bottom 0.254: v48.13,27.38 46.86,26.11 U$2.8 | v67.8,34.26 69.27,35.72 69.27,39.37 67.23,41.4 Q1.2 68.26,44.1 C2.2
N$64
  Bottom 0.254: C5-3.2 R5-6.2 58.29,43.84 56.39,45.74 U5.5 57.6,46.13 R5-5.1
N$65
  Bottom 0.254: U5.6 55.12,43.9 55.43,43.59 | 55.43,43.59 54.48,43.59 54.29,43.78 54.29,44.03 54.13,44.2 52.3,44.2 51.59,43.49 51.59,42.33 50.65,41.39 R5-3.1 | 55.43,43.59 R5-4.2
N$66
  Bottom 0.254: R5-4.1 R5-7.2 53.21,41.05 50.98,38.81 44.32,38.81 42.93,40.21 42.93,51.05 39.62,54.36 23.04,54.36 18.92,50.24 10.03,50.24 8.76,48.97 8.76,26.11 6.22,23.57 AC5.1
N$67  (via drill 0.35)
  Top 0.254: v46.25,22.3 36.14,22.3 v36.09,22.25 | v2.41,13.41 1.8,14.02 1.8,48.36 3.68,50.24 18.92,50.24 20.19,51.51 v20.19,54.05 | v64.69,49.81 64.69,48.62 65.41,47.9 Q1.1
  Bottom 0.254: v46.25,22.3 47.73,22.3 48.13,22.71 U$2.7 | v36.09,22.25 18.97,22.25 17.65,20.93 17.65,14.68 15.8,12.83 3,12.83 v2.41,13.41 | v20.19,54.05 21.46,55.32 60.53,55.32 62.1,53.75 62.1,52.48 63.05,51.53 C3.2 64.69,50.21 v64.69,49.81
N$70  (via drill 0.35)
  Top 0.254: v39.24,33.73 35.43,33.73 31.62,29.92 v31.62,27.38
  Bottom 0.254: U8.7 42.73,31.62 R10.2 42.73,33.23 41.86,32.36 40.21,32.36 39.73,32.84 39.73,33.25 v39.24,33.73 | E5.1 32.23,26.77 v31.62,27.38
N$74
  Bottom 0.254: RP6.S 16.13,19.51 16.13,39.19 24,47.07 24,51.51 25.91,53.42 33.15,53.42 33.53,53.03 U6.3 33.53,51.51 33.53,50.24 33.66,50.11 35.97,50.11 36.09,50.24 36.09,51.16 36.26,51.32 37.79,51.32 37.95,51.16 37.95,48.67 C6-2.2
N$75
  Bottom 0.254: R6-2.1 26.86,44.52 R6-3.2 32.26,45.48 U6.7
N$76
  Bottom 0.254: R6-2.2 28.76,47.07 R6-1.1 29.66,48.02 32.26,50.62 U6.2
N$78
  Bottom 0.254: C6-3.2 R6-6.2 36.7,42.88 34.8,44.78 U6.5 36.01,45.16 R6-5.1
N$79
  Bottom 0.254: U6.6 33.53,42.94 R6-4.2 33.84,42.3 32.89,41.35 30.03,41.35 R6-3.1
N$80
  Bottom 0.254: R6-4.1 R6-7.2 31.62,40.08 30.1,38.56 22.1,38.56 21.06,39.6 17.51,39.6 16.76,38.85 16.76,15.06 15.11,13.41 8.76,13.41 AC6.1
N$88
  Bottom 0.254: C7-2.2 53.53,8.33 | 53.53,8.33 56.26,8.33 57.66,6.93 U7.3 | RP7.S 16.26,5.92 25.53,5.92 29.08,2.36 39.62,2.36 40.51,3.25 42.16,4.9 45.09,4.9 46.86,6.68 50.29,6.68 51.44,5.54 52.96,5.54 53.23,5.81 53.23,7.98 53.53,8.28 53.53,8.33
N$89
  Bottom 0.254: R7-2.1 64.32,12.78 R7-3.2 62.1,14.65 58.93,11.47 U7.7
N$90
  Bottom 0.254: R7-2.2 62.42,10.23 R7-1.1 61.66,9.28 60.71,8.33 60.33,8.33 58.93,6.93 U7.2
N$92
  Bottom 0.254: C7-3.2 R7-6.2 54.48,14.43 56.39,12.52 U7.5 55.18,12.14 R7-5.1
N$93
  Bottom 0.254: U7.6 57.66,13.79 57.02,14.43 R7-4.2 57.34,15 58.29,15.95 60.52,15.95 61.47,16.9 R7-3.1
N$94
  Bottom 0.254: R7-4.1 R7-7.2 60.65,17.98 64.14,17.98 68.07,14.05 68.07,6.45 65,3.38 55.75,3.38 54.23,4.9 50.93,4.9 49.66,6.17 47.12,6.17 45.09,4.14 42.55,4.14 41.02,2.62 40.26,1.85 28.62,1.85 25.95,4.52 16.38,4.52 15.11,5.79 10.03,5.79 AC7.1
R1
  Top 0.254: U$1.P$35 29.72,23.57 24,23.57 16.89,30.68 16.89,39.32 17.65,40.08 22.25,40.08 26.14,43.97 26.14,50.73 29.74,54.33 39.98,54.33 41.84,52.48 48.45,52.48 R1.2
R2
  Top 0.254: U$1.P$34 30.99,24.84 24,24.84 17.65,31.19 17.65,36.27 19.18,37.8 20.62,37.8 26.54,43.71 26.54,48.97 27.81,50.24 R2.2
R3  (via drill 0.35)
  Top 0.254: v53.36,18.34 53.51,18.49 64.97,18.49 65.91,17.55 65.91,9.6 63.37,7.06 R3.2 | v50.15,19.54 48.96,18.34 v48.28,18.34 | v46.76,19.66 46.65,19.76 37.97,19.76 37.34,20.4 U$1.P$33
  Bottom 0.254: v53.36,18.34 51.34,18.34 v50.15,19.54 | v48.28,18.34 48.07,18.34 v46.76,19.66
R4
  Bottom 0.254: U$1.P$32 37.34,18.49 29.34,18.49 28.4,17.55 28.4,9.02 30.35,7.06 R4.2
R5  (via drill 0.35)
  Top 0.254: v17.65,38.81 19.92,38.81 v20.19,38.53
  Bottom 0.254: v17.65,38.81 17.65,28.4 22.03,24.02 37.53,24.02 39.24,22.3 41.15,22.3 U$1.P$31 | R5.2 64.19,47.53 64.19,41.25 60.45,37.52 21.21,37.52 v20.19,38.53
R6  (via drill 0.35)
  Top 0.254: v44.45,24.08 43.69,24.84 v32.89,24.84
  Bottom 0.254: R6.2 39.24,50.24 41.48,48.01 41.48,40.84 38.69,38.05 21.59,38.05 20.85,38.79 20.85,38.81 20.46,39.19 19.68,39.19 18.29,37.8 18.29,28.85 22.3,24.84 v32.89,24.84 | U$1.P$30 44.45,21.54 v44.45,24.08
R7
  Bottom 0.254: U$1.P$29 49.4,19.13 49.4,9.6 51.94,7.06 R7.2
U1-1
  Top 0.254: C1-1.2 R1-1.2 59.18,52.54 U1.1 57.66,53.87 57.4,54.13 56.18,54.13 55.75,53.7 55.75,51.36 55.14,50.75 53.27,50.75 52.86,51.16 52.82,51.16 52.77,51.21 R1.1
U5-1
  Bottom 0.254: C5-1.2 R5-1.2 51.05,52.54 U5.1 52.58,53.49 53.09,54 54.18,54 54.48,53.7 54.48,51.38 54.78,51.08 58.49,51.08 R5.1
U6-1
  Bottom 0.254: C6-1.2 R6-1.2 29.46,51.57 U6.1 30.99,52.65 31.28,52.95 32.72,52.95 32.89,52.78 32.89,49.99 33.4,49.48 36.26,49.48 R6.1
VCC  (via drill 0.35)
  Top 0.254: U1.8 57.66,48.41 57.2,48.87 v55.75,48.87 | v33.53,48.21 35.43,48.21 36.07,47.57 U2.8 36.07,44.78 36.83,44.02 39.12,44.02 39.26,44.17 39.26,46.08 39.43,46.24 40.96,46.24 41.12,46.08 41.12,41.87 v42.16,40.83 43.66,42.34 43.66,50.51 44.05,50.9 44.59,50.9 44.98,50.51 44.98,48.98 46.57,47.4 v47.12,47.4 | v56.77,9.09 55.75,9.09 55.12,9.73 U3.8 | U$1.P$3 25.91,37.54 41.99,37.54 v43,38.56 | v68.45,24.84 69.22,24.07 69.22,12.14 68.45,11.37 | 68.45,11.37 68.18,11.1 v66.78,11.1 | v44.32,13.41 45.59,14.68 46.86,14.68 47.24,14.3 v47.37,14.3 | v47.88,7.95 48.13,7.7 48.13,5.79 v49.4,4.52 | v51.94,1.98 63.58,1.98 68.45,6.86 68.45,11.37 | v57.17,33.1 57.17,32.61 55.5,30.94 v48.18,30.94
  Bottom 0.254: C-S7.2 35.43,29.92 | 35.43,29.92 C-S6.2 | C-S6.2 C-S8.2 C-S5.2 | U$1.P$3 22.73,34.37 E2.1 22.73,31.52 23.5,30.76 29.11,30.76 29.52,31.17 30.91,31.17 31.28,31.17 31.33,31.17 C-S6.2 | 45.9,28.65 64.64,28.65 65.59,27.7 R-VR1.2 68.13,24.84 v68.45,24.84 | 45.9,28.65 41.78,28.65 | 41.78,28.65 36.7,28.65 35.43,29.92 | v33.53,48.21 31.62,48.21 30.99,47.57 U6.8 | v66.78,11.1 66.42,10.74 63.83,10.74 63.35,11.22 63.35,13.06 63.19,13.22 61.66,13.22 61.49,13.06 61.49,12.11 60.26,10.87 U7.8 60.2,9.86 59.82,9.47 57.15,9.47 v56.77,9.09 | v43,38.56 42.16,39.4 v42.16,40.83 | v47.12,47.4 47.31,47.21 49.22,47.21 49.42,47 49.42,45.21 49.59,45.05 51.88,45.05 52.51,45.68 52.51,47.27 U5.8 52.58,48.41 53.03,48.87 v55.75,48.87 | U4.8 39.9,12.23 39.9,13.06 40.07,13.22 41.6,13.22 41.76,13.06 41.76,11.15 42.29,10.62 44.07,10.62 44.32,10.87 v44.32,13.41 | v47.37,14.3 47.37,8.46 v47.88,7.95 | v49.4,4.52 v51.94,1.98 | U$2.18 56.92,33.35 v57.17,33.1 | v48.18,30.94 45.9,28.65 | R9.2 40.83,25.69 U8.3 41.15,28.02 41.78,28.65
VFF  (via drill 0.35)
  Top 0.254: RP5.E RP6.E | RP7.E 12.57,7.06 4.95,7.06 3.68,8.33 AC7.2 AC6.2 | v8.76,18.49 6.22,21.03 4.95,21.03 AC5.2 | AC3.2 4.75,35 6.35,36.6 12.96,36.6 14.56,35 RP3.E | v64.64,13.47 63.31,12.14 R3-5.2 | v35.9,8.8 35.9,6.26 34.16,4.52 | 34.16,4.52 v31.62,4.52 | v50.29,13.79 48.51,13.79 46.1,11.38 46.1,5.03 45.59,4.52 34.16,4.52 | RP2.E 16.38,42.62 v22.73,42.62 | v32.89,48.97 31.62,47.7 31.62,47.07 30.81,46.25 29.28,46.25 28.18,45.16 R2-5.2 | v54.59,49.53 54.07,49.53 53.09,48.54 53.09,47.78 52.53,47.22 50.85,47.22 49.76,46.13 R1-5.2 | v17.63,26.11 15.11,28.63 RP4.E | v66.78,12.14 66.78,13.26 67.94,14.43 v67.94,15.7 | v36.85,23.14 55.32,23.14 v57.02,24.84 60.83,28.65 64.9,28.65 69.22,32.97 69.22,38.91 64.41,43.71 v62.48,43.71
  Bottom 0.254: RP1.E RP2.E RP3.E RP4.E RP5.E 15.11,21.03 12.57,18.49 v8.76,18.49 6.22,18.49 AC6.2 | AC4.2 AC3.2 AC2.2 AC1.2 | v66.78,12.14 65.45,13.47 v64.64,13.47 | v35.9,8.8 34.02,8.8 33.5,9.31 33.5,10.62 33.06,11.06 31.8,11.06 30.72,12.14 R4-5.2 | v31.62,4.52 27.81,4.52 22.73,9.6 RP7.E | R7-5.2 50.61,13.79 v50.29,13.79 | v22.73,42.62 24,42.62 25.27,43.89 25.27,45.42 26.1,46.24 27.63,46.24 27.83,46.04 27.83,44.24 28,44.08 29.53,44.08 29.69,44.24 29.69,47.04 31.62,48.97 v32.89,48.97 34.16,48.97 35.43,47.7 35.43,46.94 36.12,46.25 37.82,46.25 R6-5.2 | v54.59,49.53 54.87,49.81 55.75,49.81 57.1,48.46 57.1,47.95 57.84,47.22 59.38,47.22 60.48,46.13 R5-5.2 62.48,44.16 v62.48,43.71 | v36.85,23.14 20.6,23.14 v17.63,26.11 | v67.94,15.7 67.94,15.82 69.22,17.09 69.22,21.54 67.18,23.57 64.64,23.57 63.69,24.52 C-VR1.2 63.37,25.16 TL1.2 | TL1.2 TL1.1 61.62,27.38 R-VR1.1 | v57.02,24.84 57.34,25.16 TL1.2